# EAGLE schematic e-Bike System (EAGLE 7.7.0)
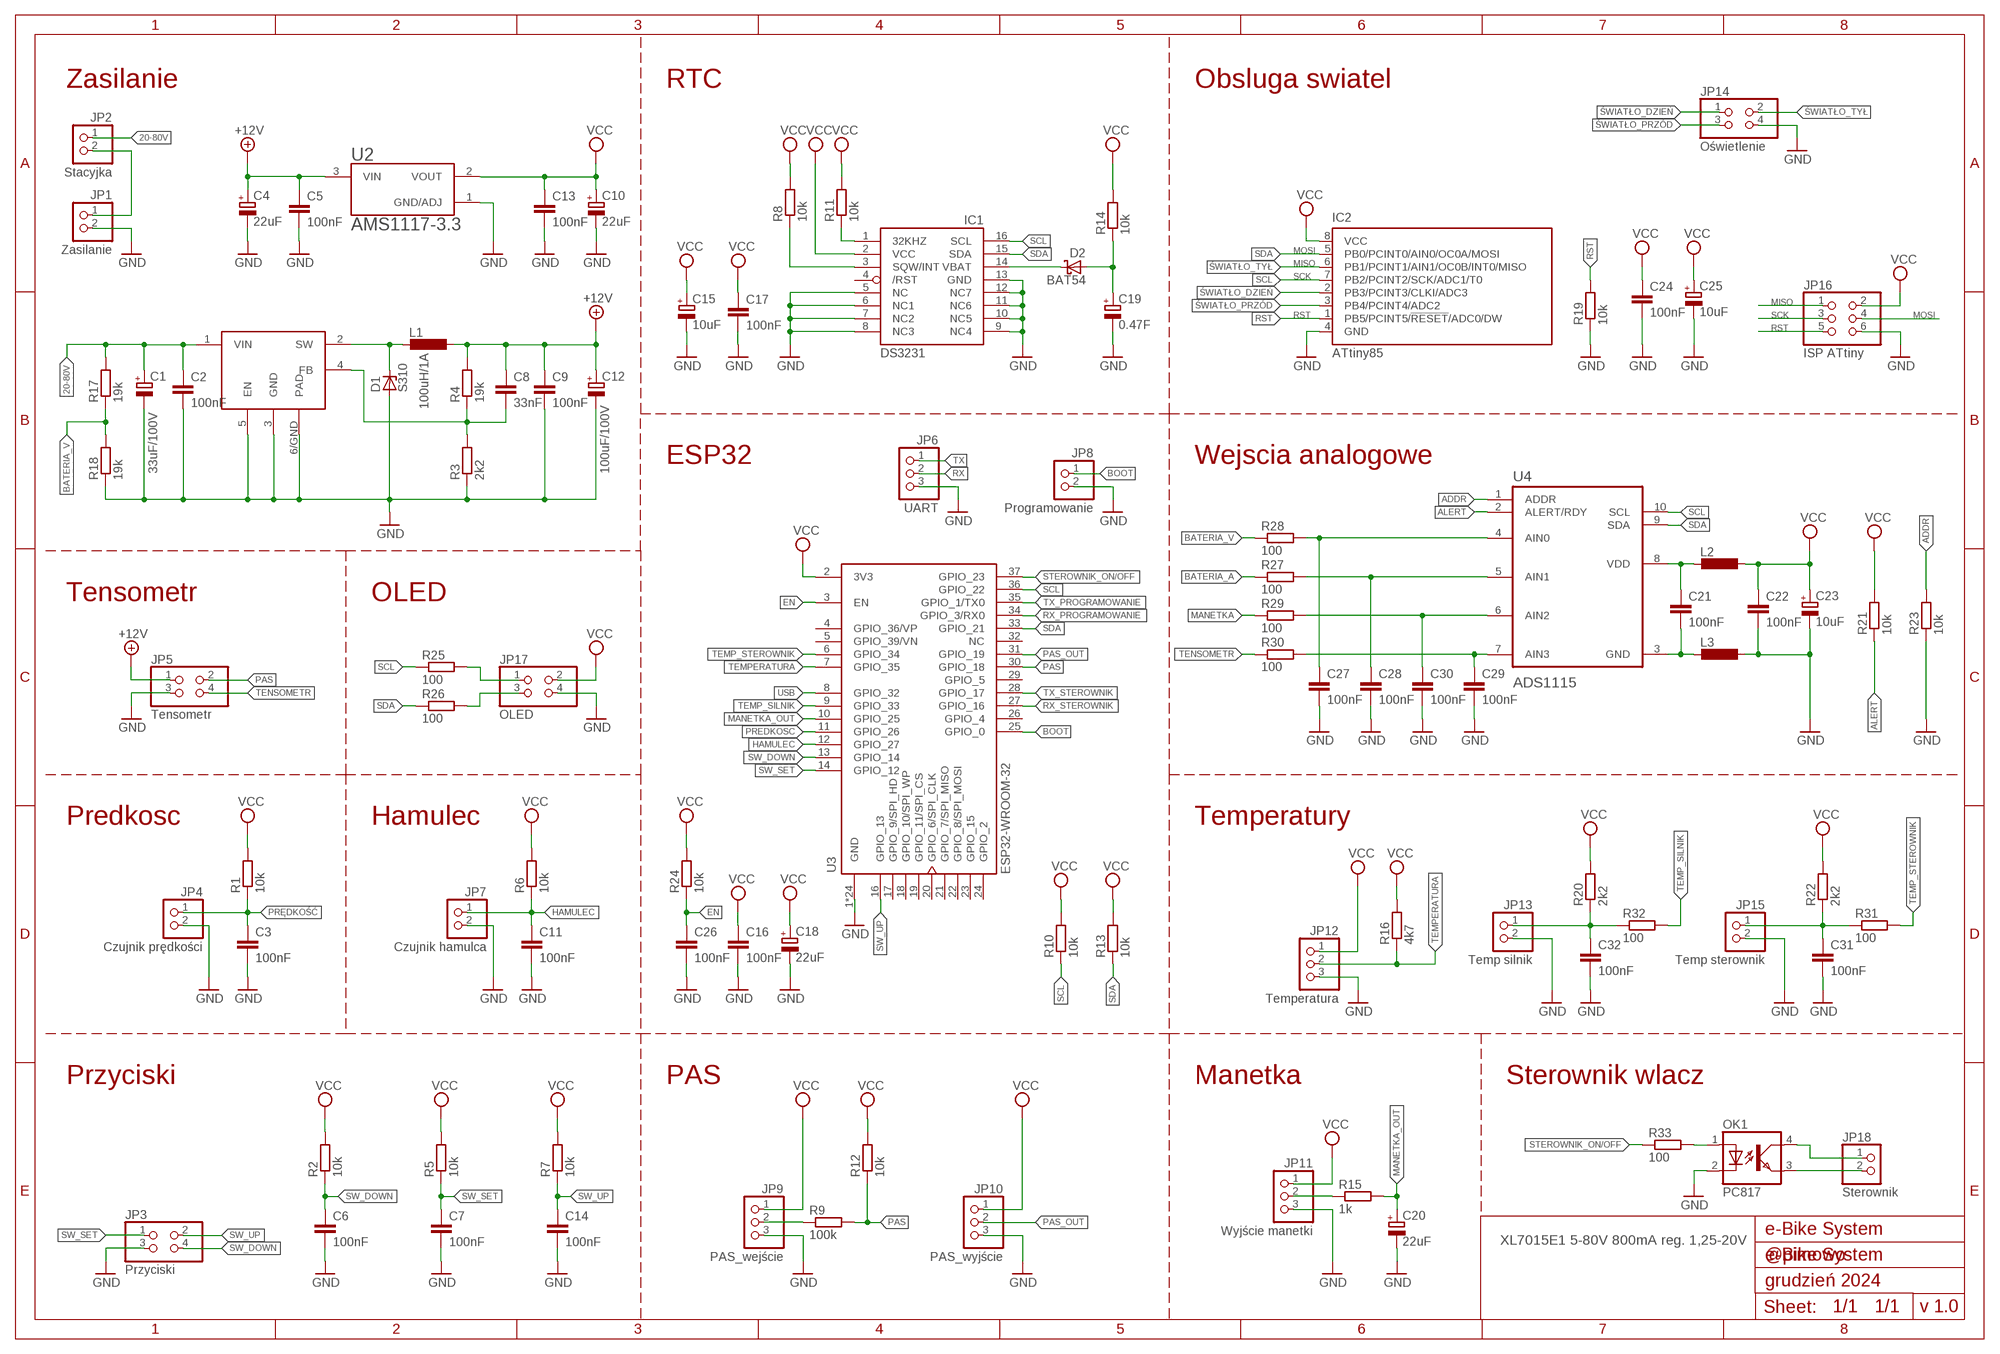
[diagram p0: schematic, sheet 1]

## Parts
C1  CPOL-EUE1.8-4  [E1,8-4]
C2  100nF  C-EUC1206K  [C1206K]
C3  100nF  C-EUC1206K  [C1206K]
C4  22uF  CPOL-EUE1.8-4  [E1,8-4]
C5  100nF  C-EUC1206K  [C1206K]
C6  100nF  C-EUC1206K  [C1206K]
C7  100nF  C-EUC1206K  [C1206K]
C8  33nF  C-EUC1206K  [C1206K]
C9  100nF  C-EUC1206K  [C1206K]
C10  22uF  CPOL-EUE1.8-4  [E1,8-4]
C11  100nF  C-EUC1206K  [C1206K]
C12  CPOL-EUE1.8-4  [E1,8-4]
C13  100nF  C-EUC1206K  [C1206K]
C14  100nF  C-EUC1206K  [C1206K]
C15  10uF  CPOL-EUE1.8-4  [E1,8-4]
C16  100nF  C-EUC1206K  [C1206K]
C17  100nF  C-EUC1206K  [C1206K]
C18  22uF  CPOL-EUE1.8-4  [E1,8-4]
C19  0.47F  CPOL-EUE7.5-16  [E7,5-16]
C20  22uF  CPOL-EUE1.8-4  [E1,8-4]
C21  100nF  C-EUC1206K  [C1206K]
C22  100nF  C-EUC1206K  [C1206K]
C23  10uF  CPOL-EUE1.8-4  [E1,8-4]
C24  100nF  C-EUC1206K  [C1206K]
C25  10uF  CPOL-EUE1.8-4  [E1,8-4]
C26  100nF  C-EUC1206K  [C1206K]
C27  100nF  C-EUC1206K  [C1206K]
C28  100nF  C-EUC1206K  [C1206K]
C29  100nF  C-EUC1206K  [C1206K]
C30  100nF  C-EUC1206K  [C1206K]
C31  100nF  C-EUC1206K  [C1206K]
C32  100nF  C-EUC1206K  [C1206K]
D1  S310  ZENER-DIODESMB  [SMB]
D2  BAT54  [SOT23]
IC1  DS3231/SO  [SO16W]
IC2  ATtiny85  TINY13-20SSU  [8S1]
JP1  Zasilanie  PINHD-1X2  [1X02]
JP2  Stacyjka  PINHD-1X2  [1X02]
JP3  Przyciski  PINHD-2X2  [2X02]
JP4  Czujnik prędkości  PINHD-1X2  [1X02]
JP5  Tensometr  PINHD-2X2  [2X02]
JP6  UART  PINHD-1X3  [1X03]
JP7  Czujnik hamulca  PINHD-1X2  [1X02]
JP8  Programowanie  PINHD-1X2  [1X02]
JP9  PAS_wejście  PINHD-1X3  [1X03]
JP10  PAS_wyjście  PINHD-1X3  [1X03]
JP11  Wyjście manetki  PINHD-1X3  [1X03]
JP12  Temperatura  PINHD-1X3  [1X03]
JP13  Temp silnik  PINHD-1X2  [1X02]
JP14  Oświetlenie  PINHD-2X2  [2X02]
JP15  Temp sterownik  PINHD-1X2  [1X02]
JP16  ISP ATtiny  PINHD-2X3  [2X03]
JP17  OLED  PINHD-2X2  [2X02]
JP18  Sterownik  PINHD-1X2  [1X02]
L1  L-EUL5650M  [L5650M]
L2  L-EUL1812  [L1812]
L3  L-EUL1812  [L1812]
OK1  PC817  [DIL04]
R1  10k  R-EU_M1206  [M1206]
R2  10k  R-EU_M1206  [M1206]
R3  2k2  R-EU_M1206  [M1206]
R4  19k  R-EU_M1206  [M1206]
R5  10k  R-EU_M1206  [M1206]
R6  10k  R-EU_M1206  [M1206]
R7  10k  R-EU_M1206  [M1206]
R8  10k  R-EU_M1206  [M1206]
R9  100k  R-EU_M1206  [M1206]
R10  10k  R-EU_M1206  [M1206]
R11  10k  R-EU_M1206  [M1206]
R12  10k  R-EU_M1206  [M1206]
R13  10k  R-EU_M1206  [M1206]
R14  10k  R-EU_M1206  [M1206]
R15  1k  R-EU_M1206  [M1206]
R16  4k7  R-EU_M1206  [M1206]
R17  19k  R-EU_M1206  [M1206]
R18  19k  R-EU_M1206  [M1206]
R19  10k  R-EU_M1206  [M1206]
R20  2k2  R-EU_M1206  [M1206]
R21  10k  R-EU_M1206  [M1206]
R22  2k2  R-EU_M1206  [M1206]
R23  10k  R-EU_M1206  [M1206]
R24  10k  R-EU_M1206  [M1206]
R25  100  R-EU_M1206  [M1206]
R26  100  R-EU_M1206  [M1206]
R27  100  R-EU_M1206  [M1206]
R28  100  R-EU_M1206  [M1206]
R29  100  R-EU_M1206  [M1206]
R30  100  R-EU_M1206  [M1206]
R31  100  R-EU_M1206  [M1206]
R32  100  R-EU_M1206  [M1206]
R33  100  R-EU_M1206  [M1206]
U1  XL7015  [TO-252-5L]
U2  AMS1117-3.3  [SOT229P700X180-4N]
U3  ESP32-WROOM-32  [MODULE_ESP32-WROOM-32]
U4  ADS1115  ADS1115IDGST  [SOP50P490X110-10N]

## Nets
20-80V: C1.+ C2.1 JP2.1 R17.2 U1.1(VIN)
+12V: C4.+ C5.1 C8.1 C9.1 C12.+ JP5.1 L1.1 R4.2 U2.3(VIN)
ADDR: R23.2 U4.1(ADDR)
ALERT: R21.1 U4.2(ALERT/RDY)
BATERIA_A: C28.1 R27.1 R27.2 U4.5(AIN1)
BATERIA_V: C27.1 R17.1 R18.2 R28.1 R28.2 U4.4(AIN0)
BOOT: JP8.1 U3.25(GPIO_0)
EN: C26.1 R24.1 U3.3(EN)
GND: C1.- C2.2 C3.2 C4.- C5.2 C6.2 C7.2 C9.2 C10.- C11.2 C12.- C13.2 C14.2 C15.- C16.2 C17.2 C18.- C19.- C20.- C22.2 C23.- C24.2 C25.- C26.2 C27.2 C28.2 C29.2 C30.2 C31.2 C32.2 D1.A IC1.5(NC) IC1.6(NC1) IC1.7(NC2) IC1.8(NC3) IC1.9(NC4) IC1.10(NC5) IC1.11(NC6) IC1.12(NC7) IC1.13(GND) IC2.4(GND) JP1.2 JP3.3 JP4.2 JP5.3 JP6.3 JP7.2 JP8.2 JP9.3 JP10.3 JP11.3 JP12.3 JP13.2 JP14.4 JP15.2 JP16.6 JP17.4 L3.1 OK1.2(C) R3.1 R18.1 R19.1 R23.1 U1.3(GND) U1.5(EN) U1.6/GND(PAD) U2.1(GND/ADJ) U3.1(GND) U3.15(GND) U3.38(GND) U3.39_1(GND) U3.39_2(GND) U3.39_3(GND) U3.39_4(GND) U3.39_5(GND) U3.39_6(GND) U3.39_7(GND) U3.39_8(GND) U3.39_9(GND) U3.39_10(GND) U3.39_11(GND) U3.39_12(GND) U3.39_13(GND) U3.39_14(GND) U3.39_15(GND) U3.39_16(GND) U3.39_17(GND) U3.39_18(GND) U3.39_19(GND) U3.39_20(GND) U3.39_21(GND)
HAMULEC: C11.1 JP7.1 R6.1 U3.12(GPIO_27)
MANETKA: C30.1 R29.1 R29.2 U4.6(AIN2)
MANETKA_OUT: C20.+ R15.2 U3.10(GPIO_25)
N$1: JP11.2 R15.1
N$2: JP9.2 R9.1
N$3: JP17.3 R26.2
N$5: IC1.1(32KHZ) R11.1
N$6: IC1.3(SQW/INT) R8.1
N$7: C19.+ D2.1(A) R14.1
N$8: D2.3(C) IC1.14(VBAT)
N$9: JP1.1 JP2.2
N$10: JP17.1 R25.2
N$15: OK1.1(A) R33.2
N$16: JP18.1 OK1.4(COL)
N$17: JP18.2 OK1.3(EMIT)
N$18: C21.2 L3.2 U4.3(GND)
N$19: C8.2 R3.2 R4.1 U1.4(FB)
N$21: D1.C L1.2 U1.2(SW)
PAS: JP5.2 R9.2 R12.1 U3.30(GPIO_18)
PAS_OUT: JP10.2 U3.31(GPIO_19)
PREDKOSC: U3.11(GPIO_26)
PRĘDKOŚĆ: C3.1 JP4.1 R1.1
RST: IC2.1(PB5/PCINT5/!RESET!/ADC0/DW) JP16.5 R19.2
RX: JP6.2
RX_PROGRAMOWANIE: U3.34(GPIO_3/RX0)
RX_STEROWNIK: U3.27(GPIO_16)
SCL: IC1.16(SCL) IC2.7(PB2/PCINT2/SCK/ADC1/T0) JP16.3 R10.1 R25.1 U3.36(GPIO_22) U4.10(SCL)
SDA: IC1.15(SDA) IC2.5(PB0/PCINT0/AIN0/OC0A/MOSI) JP16.4 R13.1 R26.1 U3.33(GPIO_21) U4.9(SDA)
STEROWNIK_ON/OFF: R33.1 U3.37(GPIO_23)
SW_DOWN: C6.1 JP3.4 R2.1 U3.13(GPIO_14)
SW_SET: C7.1 JP3.1 R5.1 U3.14(GPIO_12)
SW_UP: C14.1 JP3.2 R7.1 U3.16(GPIO_13)
TEMP_SILNIK: C32.1 JP13.1 R20.1 R32.1 R32.2 U3.9(GPIO_33)
TEMP_STEROWNIK: C31.1 JP15.1 R22.1 R31.1 R31.2 U3.6(GPIO_34)
TEMPERATURA: JP12.2 R16.1 U3.7(GPIO_35)
TENSOMETR: C29.1 JP5.4 R30.1 R30.2 U4.7(AIN3)
TX: JP6.1
TX_PROGRAMOWANIE: U3.35(GPIO_1/TX0)
TX_STEROWNIK: U3.28(GPIO_17)
USB: U3.8(GPIO_32)
VCC: C10.+ C13.1 C15.+ C16.1 C17.1 C18.+ C22.1 C23.+ C24.1 C25.+ IC1.2(VCC) IC2.8(VCC) JP9.1 JP10.1 JP11.1 JP12.1 JP16.2 JP17.2 L2.1 R1.2 R2.2 R5.2 R6.2 R7.2 R8.2 R10.2 R11.2 R12.2 R13.2 R14.2 R16.2 R20.2 R21.2 R22.2 R24.2 U2.2(VOUT) U3.2(3V3)
VDD: C21.1 L2.2 U4.8(VDD)
ŚWIATŁO_DZIEŃ: IC2.2(PB3/PCINT3/CLKI/ADC3) JP14.1
ŚWIATŁO_PRZÓD: IC2.3(PB4/PCINT4/ADC2) JP14.3
ŚWIATŁO_TYŁ: IC2.6(PB1/PCINT1/AIN1/OC0B/INT0/MISO) JP14.2 JP16.1
Unconnected: IC1.4(/RST) U3.4(GPIO_36/VP) U3.5(GPIO_39/VN) U3.17(GPIO_9/SPI_HD) U3.18(GPIO_10/SPI_WP) U3.19(GPIO_11/SPI_CS) U3.20(GPIO_6/SPI_CLK) U3.21(GPIO_7/SPI_MISO) U3.22(GPIO_8/SPI_MOSI) U3.23(GPIO_15) U3.24(GPIO_2) U3.26(GPIO_4) U3.29(GPIO_5) U3.32(NC)

## Notes on the sheet
- Zasilanie | RTC | Obsluga swiatel
- MOSI
- MISO
- SCK
- MISO
- RST | SCK | MOSI
- RST
- 100uH/1A
- ESP32 | Wejscia analogowe
- 33uF/100V | 100uF/100V
- Tensometr | OLED
- Predkosc | Hamulec | Temperatury
- Przyciski | PAS | Manetka | Sterownik wlacz
- XL7015E1 5-80V 800mA reg. 1,25-20V | e-Bike System
- @pimowo
- grudzień 2024
- 1/1 | v 1.0

## Library data of the parts
C1 C4 C10 C12 C15 C18-C20 C23 C25 = resistor:CPOL-EU: POLARIZED CAPACITOR, European symbol
C2 C3 C5-C9 C11 C13 C14 C16 C17 C21 C22 C24 C26-C32 = resistor:C-EU: CAPACITOR, European symbol
D1 = diode:ZENER-DIODE: Z-Diode
D2 = diode:BAT54: Schottky Diodes Source: Fairchild .. BAT54.pdf
IC1 = DS3231:DS3231: Check availability <https://pricing.snapeda.com/parts/DS3231/Analog%20Devices/view-part?ref=eda>; AVAILABILITY: Not in stock; CHECK_PRICES: https://www.snapeda.com/parts/DS3231/Analog+Devices/view-part/?ref=eda; DESCRIPTION: Real Time Clock (RTC) IC Clock/Calendar - I²C, 2-Wire Serial 8-SOIC (0.154, 3.90mm Width); MF: Analog Devices; MP: DS3231; PACKAGE: SOIC-16 Maxim Integrated; PRICE: None; SNAPEDA_LINK: https://www.snapeda.com/parts/DS3231/Analog+Devices/view-part/?ref=snap
IC2 = atmel:TINY13: 8-bit AVR Microcontroller with 1K Bytes In-System Programmable Flash Source: http://www.atmel.com/dyn/resources/prod_documents/2535S.pdf; MPN: ATTINY13-20SSU; OC_FARNELL: 1455133; OC_NEWARK: 58M3771
JP1 JP2 JP4 JP7 JP8 JP13 JP15 JP18 = pinhead:PINHD-1X2: PIN HEADER
JP3 JP5 JP14 JP17 = pinhead:PINHD-2X2: PIN HEADER
JP6 JP9-JP12 = pinhead:PINHD-1X3: PIN HEADER
JP16 = pinhead:PINHD-2X3: PIN HEADER
L1-L3 = resistor:L-EU: INDUCTOR, European symbol
OK1 = optocoupler:PC817: SHARP OPTO COUPLER; MPN: PC817X4J000F; OC_FARNELL: 9707727; OC_NEWARK: 97K7059
R1-R33 = resistor:R-EU_: RESISTOR, European symbol
U1 = XL7015:XL7015: Check availability <https://pricing.snapeda.com/parts/XL7015/XLSEMI/view-part?ref=eda>; AVAILABILITY: In Stock; CHECK_PRICES: https://www.snapeda.com/parts/XL7015/XLSEMI/view-part/?ref=eda; DESCRIPTION: 0.8A 150KHz 80V Buck DC to DC; MF: XLSEMI; MP: XL7015; PACKAGE: Package; PRICE: None; SNAPEDA_LINK: https://www.snapeda.com/parts/XL7015/XLSEMI/view-part/?ref=snap
U2 = AMS1117-3.3:AMS1117-3.3: Check availability <https://pricing.snapeda.com/parts/AMS1117-3.3/Advanced%20Monolithic%20Systems/view-part?ref=eda>; AVAILABILITY: Not in stock; CHECK_PRICES: https://www.snapeda.com/parts/AMS1117-3.3/Advanced+Monolithic+Systems/view-part/?ref=eda; DESCRIPTION: Sot223/Pkg 1-Amp 3.3-Volt Low Drop Out Voltage Regulatator; MF: Advanced Monolithic Systems; MP: AMS1117-3.3; PACKAGE: SOT-223 Seeed Technology; PRICE: None; SNAPEDA_LINK: https://www.snapeda.com/parts/AMS1117-3.3/Advanced+Monolithic+Systems/view-part/?ref=snap
U3 = ESP32-WROOM-32:ESP32-WROOM-32: Check availability <https://pricing.snapeda.com/parts/ESP32-WROOM-32/Espressif%20Systems/view-part?ref=eda>; AVAILABILITY: In Stock; CHECK_PRICES: https://www.snapeda.com/parts/ESP32-WROOM-32/Espressif+Systems/view-part/?ref=eda; DESCRIPTION: Bluetooth, WiFi 802.11b/g/n, Bluetooth v4.2 +EDR, Class 1, 2 and 3 Transceiver Module 2.4GHz ~ 2.5GHz Antenna Not Included, U.FL Surface Mount; MF: Espressif Systems; MP: ESP32-WROOM-32; PACKAGE: None; PRICE: None; SNAPEDA_LINK: https://www.snapeda.com/parts/ESP32-WROOM-32/Espressif+Systems/view-part/?ref=snap
U4 = ADS1115IDGST:ADS1115IDGST: Check availability <https://pricing.snapeda.com/parts/ADS1115IDGST/Texas%20Instruments/view-part?ref=eda>; AVAILABILITY: In Stock; CHECK_PRICES: https://www.snapeda.com/parts/ADS1115IDGST/Texas+Instruments/view-part/?ref=eda; DESCRIPTION: 16-bit, 860-SPS, 4-channel, delta-sigma ADC with PGA, oscillator, VREF, comparator and I2C; MF: Texas Instruments; MP: ADS1115IDGST; PACKAGE: VSSOP-10 Texas Instruments; PRICE: None; SNAPEDA_LINK: https://www.snapeda.com/parts/ADS1115IDGST/Texas+Instruments/view-part/?ref=snap